# Altium project RockerBox.PrjPCB (part 3 of 3)

## Sheet SMPS.SchDoc: Title
size A1; Date: Date; CompanyName: Integrated Micro-Electronics Bulgaria; Organization: Design & Development Department; Address1: Drawing Type; Address2: Address 1; Address3: Address 2; Address4: Address 3; DocumentNumber: 730xxx; Revision: 01; SheetNumber: 1; SheetTotal: 1; PageSetup: Record=PageOptions|CenterHorizontal=True|CenterVertical=True|PrintScale=0.70|XCorrection=1.00|YCorrection=1.00|PrintKind=2|BorderSize=5000000|LeftOffset=0|BottomOffset=0|Orientation=2|PaperLength=1000|PaperWidth=1000|Scale=100|PaperSource=7|PrintQuality=-4|MediaType=1|DitherType=10|PaperKind=A4|PrintScaleMode=1; SheetSize: A3; Time: Time; ModifiedDate: Mod. Date
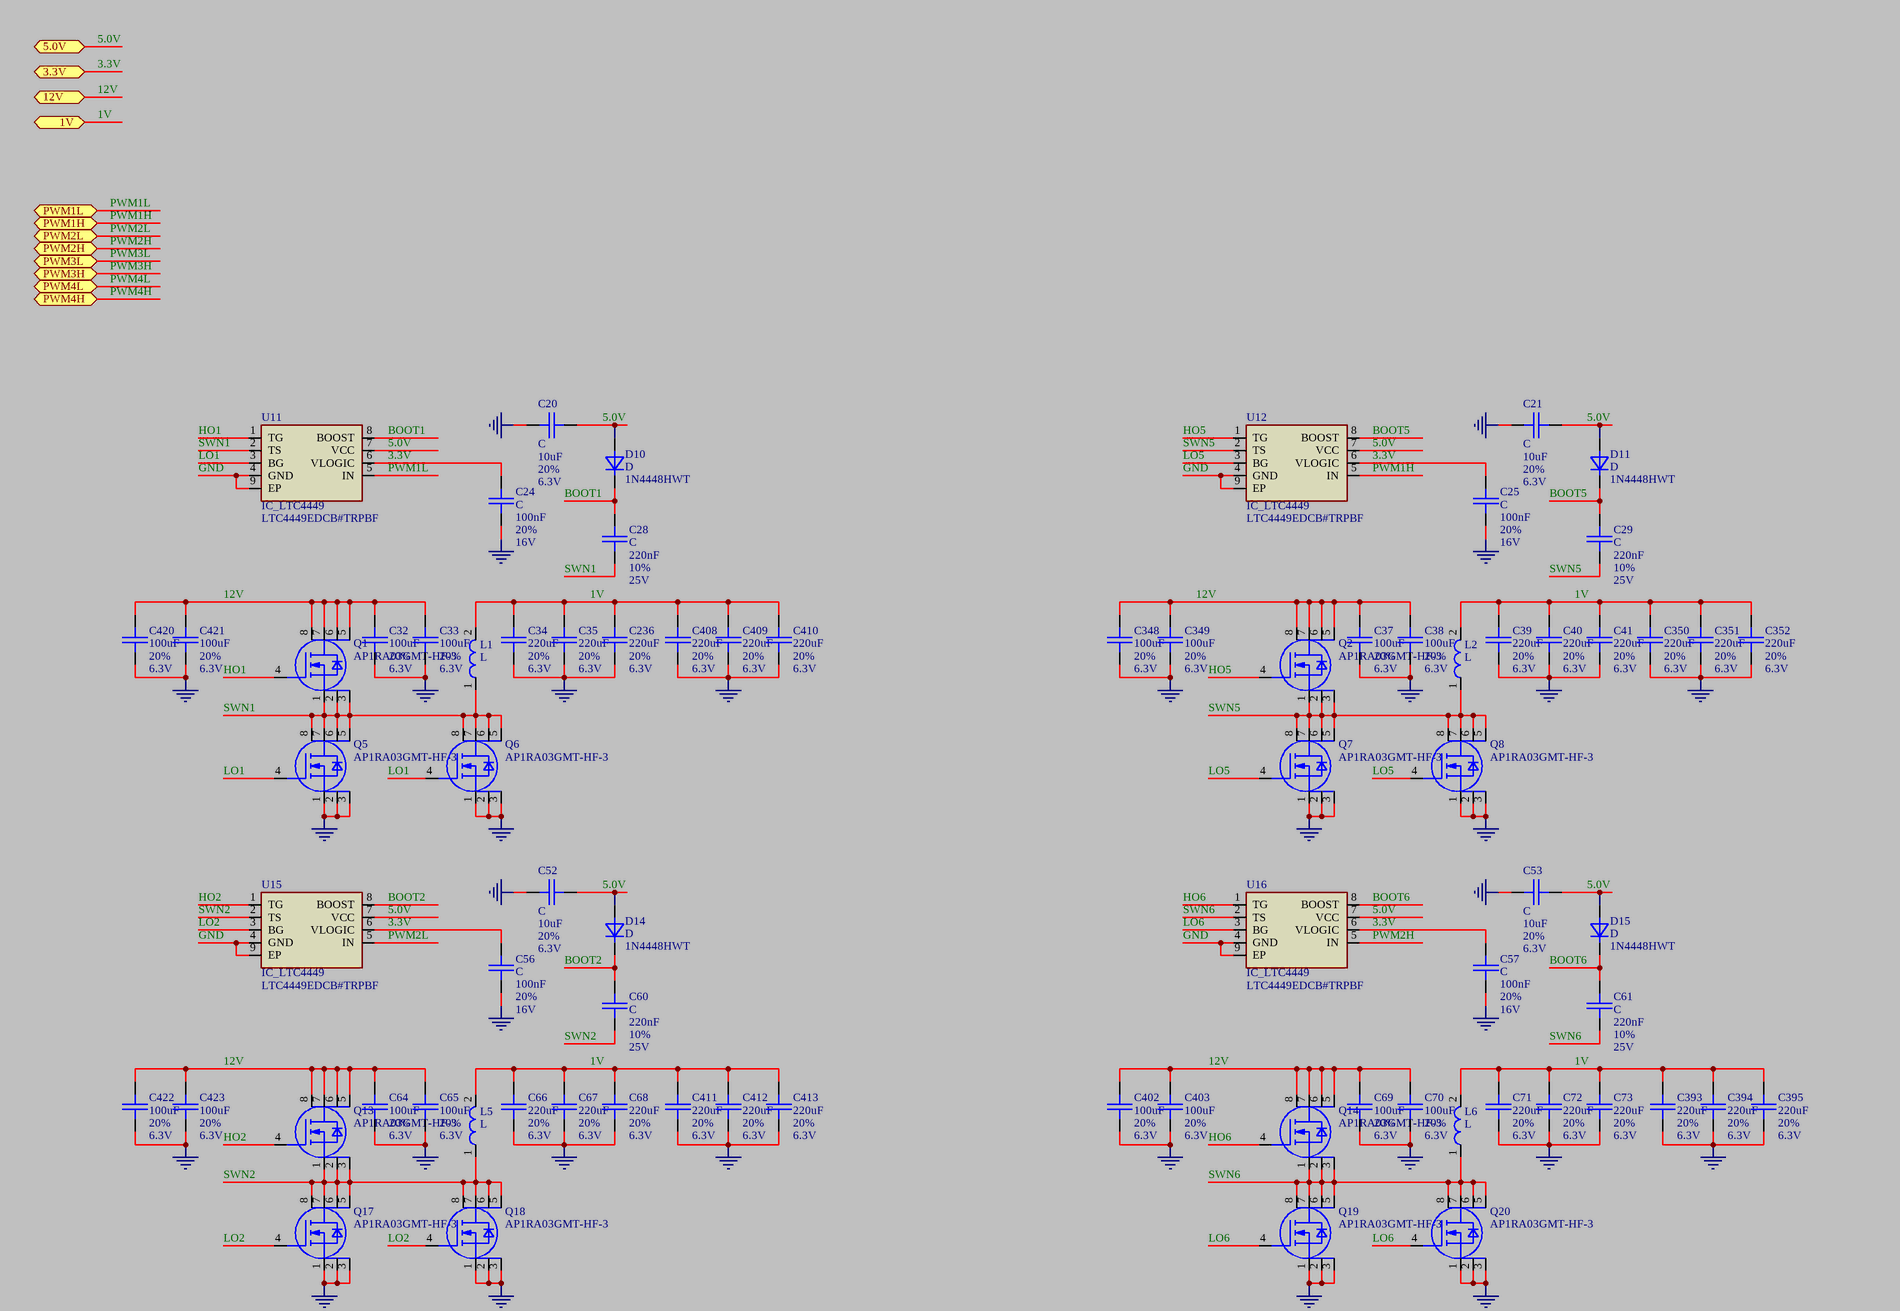
[diagram p7: SMPS.SchDoc, top left]
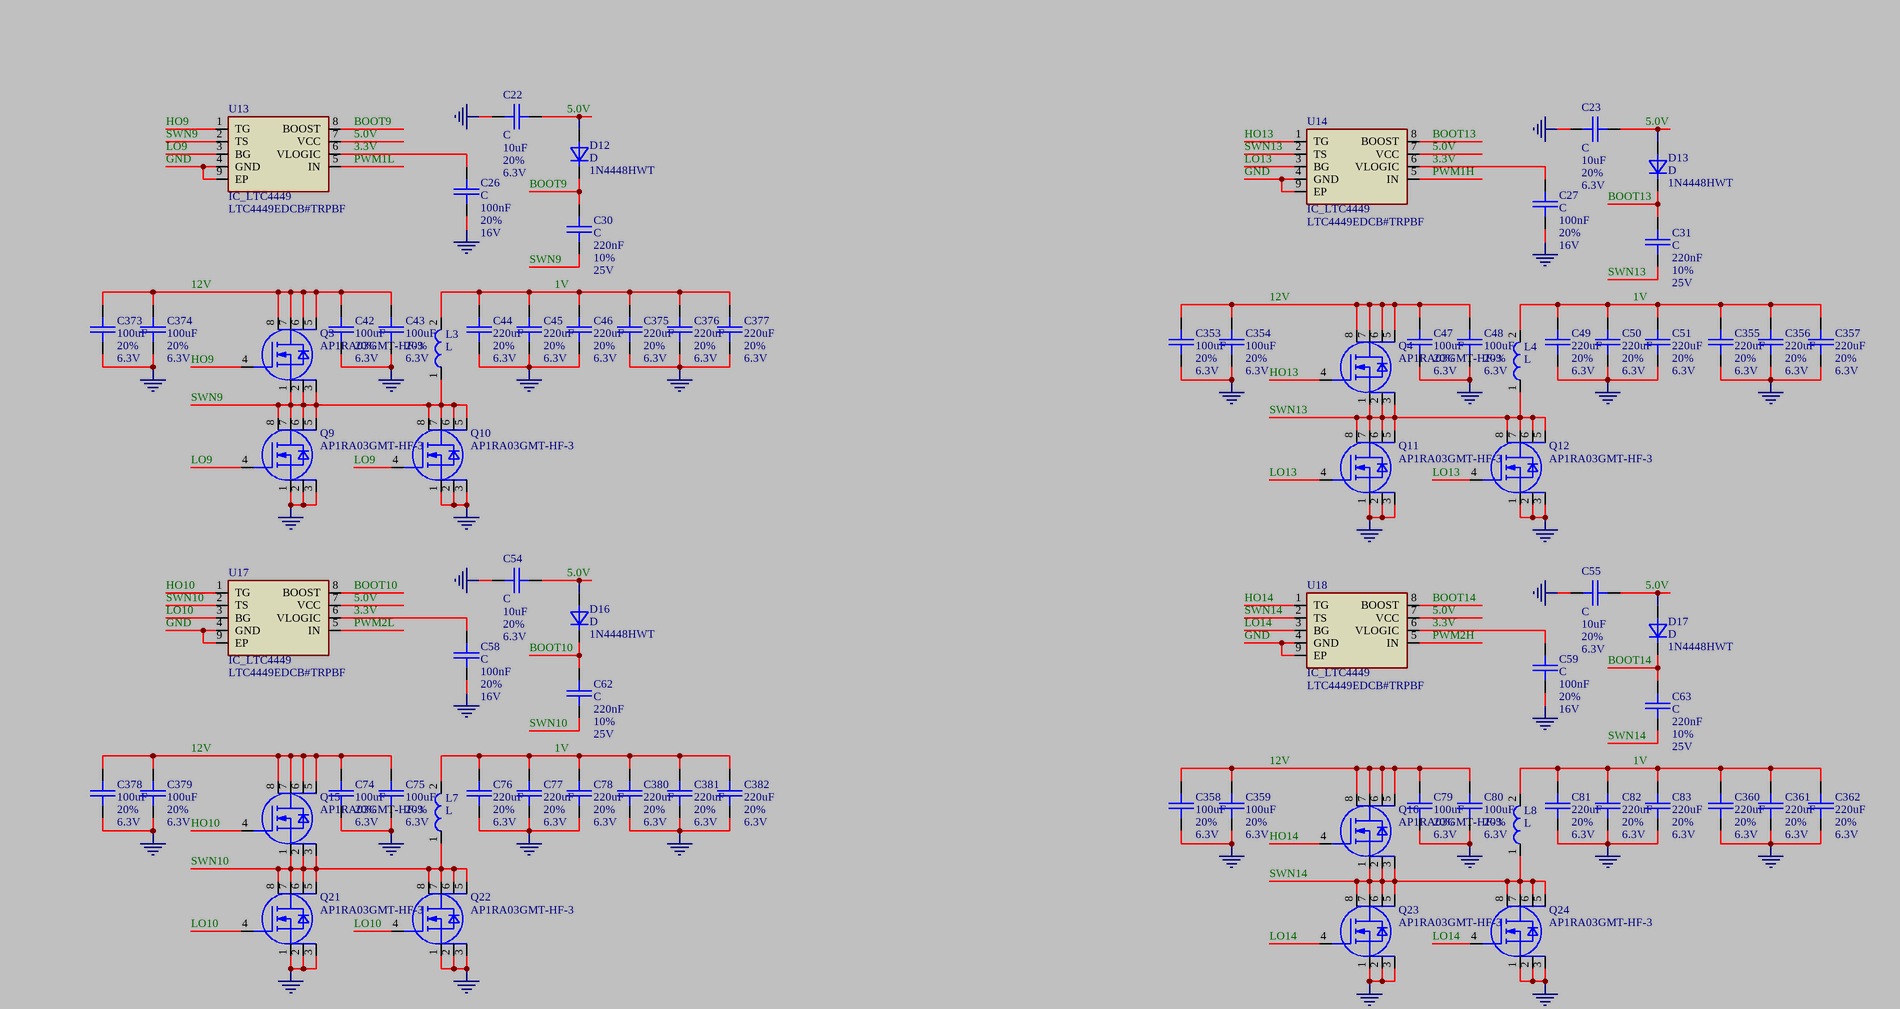
[diagram p8: SMPS.SchDoc, top right]
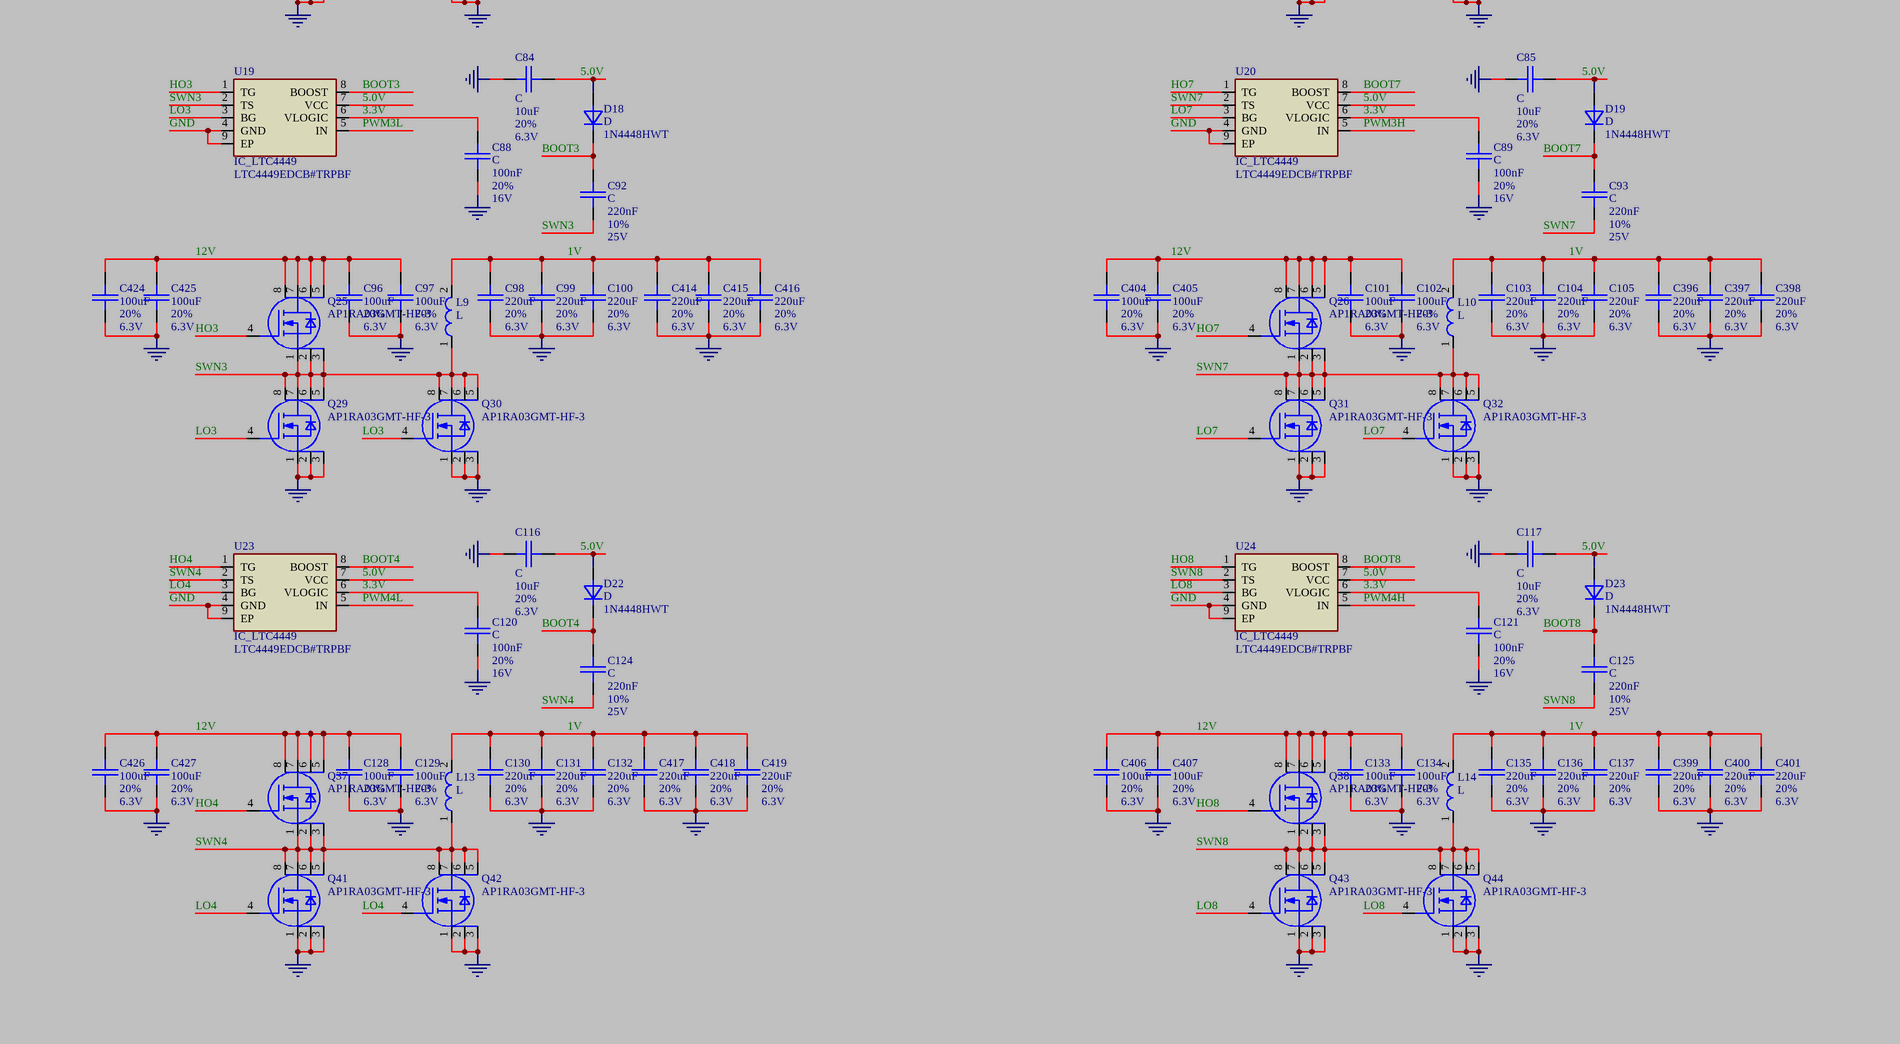
[diagram p9: SMPS.SchDoc, bottom left]
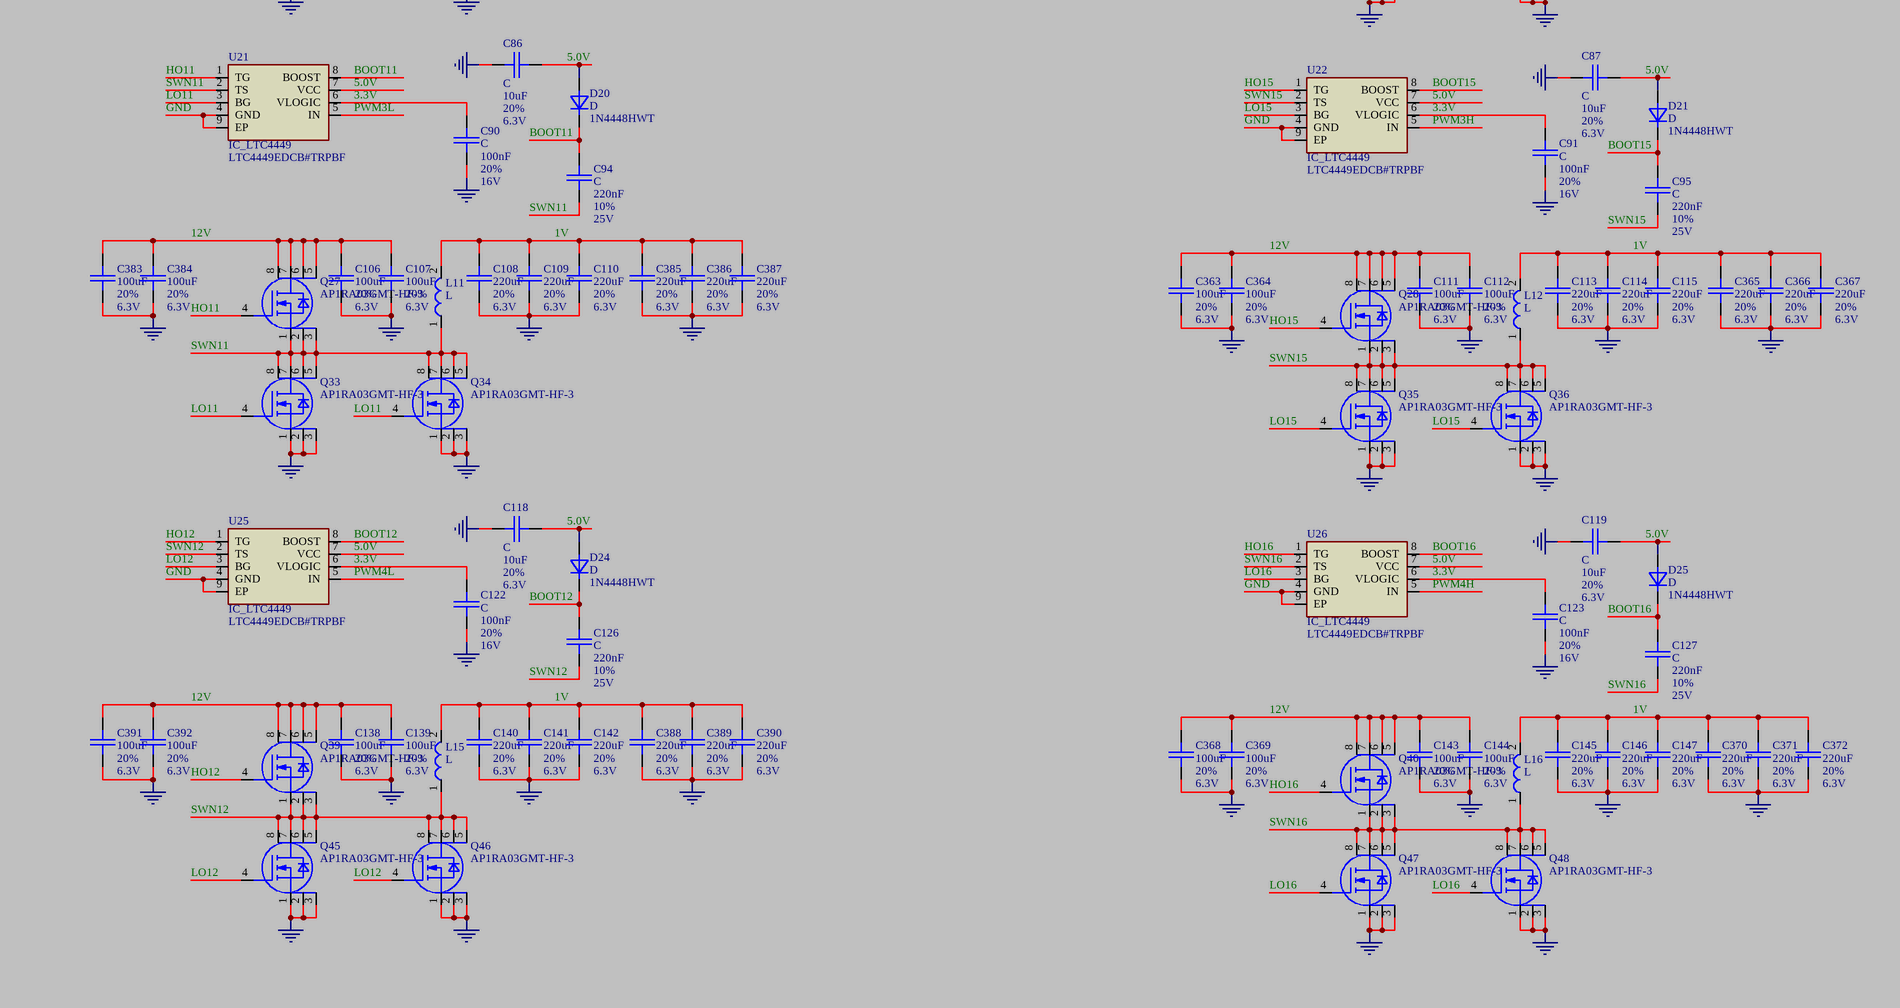
[diagram p10: SMPS.SchDoc, bottom right]

### Parts
C20  C  DB_VALUE: 10uF  DB_TOLERANCE: 20%  DB_VOLTAGE: 6.3V  [SMD_0603_CAPC1608X95N]
C21  C  DB_VALUE: 10uF  DB_TOLERANCE: 20%  DB_VOLTAGE: 6.3V  [SMD_0603_CAPC1608X95N]
C22  C  DB_VALUE: 10uF  DB_TOLERANCE: 20%  DB_VOLTAGE: 6.3V  [SMD_0603_CAPC1608X95N]
C23  C  DB_VALUE: 10uF  DB_TOLERANCE: 20%  DB_VOLTAGE: 6.3V  [SMD_0603_CAPC1608X95N]
C24  C  DB_VALUE: 100nF  DB_TOLERANCE: 20%  DB_VOLTAGE: 16V  [SMD_0402_CAPC1005X55N]
C25  C  DB_VALUE: 100nF  DB_TOLERANCE: 20%  DB_VOLTAGE: 16V  [SMD_0402_CAPC1005X55N]
C26  C  DB_VALUE: 100nF  DB_TOLERANCE: 20%  DB_VOLTAGE: 16V  [SMD_0402_CAPC1005X55N]
C27  C  DB_VALUE: 100nF  DB_TOLERANCE: 20%  DB_VOLTAGE: 16V  [SMD_0402_CAPC1005X55N]
C28  C  DB_VALUE: 220nF  DB_TOLERANCE: 10%  DB_VOLTAGE: 25V  [SMD_0603_CAPC1608X95N]
C29  C  DB_VALUE: 220nF  DB_TOLERANCE: 10%  DB_VOLTAGE: 25V  [SMD_0603_CAPC1608X95N]
C30  C  DB_VALUE: 220nF  DB_TOLERANCE: 10%  DB_VOLTAGE: 25V  [SMD_0603_CAPC1608X95N]
C31  C  DB_VALUE: 220nF  DB_TOLERANCE: 10%  DB_VOLTAGE: 25V  [SMD_0603_CAPC1608X95N]
C32  DB_VALUE: 100uF  DB_TOLERANCE: 20%  DB_VOLTAGE: 6.3V  [SMD_1210_CAPC3225X270N]  (hidden comment: C)
C33  DB_VALUE: 100uF  DB_TOLERANCE: 20%  DB_VOLTAGE: 6.3V  [SMD_1210_CAPC3225X270N]  (hidden comment: C)
C34  DB_VALUE: 220uF  DB_TOLERANCE: 20%  DB_VOLTAGE: 6.3V  [SMD_1210_CAPC3225X279N]  (hidden comment: C)
C35  DB_VALUE: 220uF  DB_TOLERANCE: 20%  DB_VOLTAGE: 6.3V  [SMD_1210_CAPC3225X279N]  (hidden comment: C)
C37  DB_VALUE: 100uF  DB_TOLERANCE: 20%  DB_VOLTAGE: 6.3V  [SMD_1210_CAPC3225X270N]  (hidden comment: C)
C38  DB_VALUE: 100uF  DB_TOLERANCE: 20%  DB_VOLTAGE: 6.3V  [SMD_1210_CAPC3225X270N]  (hidden comment: C)
C39  DB_VALUE: 220uF  DB_TOLERANCE: 20%  DB_VOLTAGE: 6.3V  [SMD_1210_CAPC3225X279N]  (hidden comment: C)
C40  DB_VALUE: 220uF  DB_TOLERANCE: 20%  DB_VOLTAGE: 6.3V  [SMD_1210_CAPC3225X279N]  (hidden comment: C)
C41  DB_VALUE: 220uF  DB_TOLERANCE: 20%  DB_VOLTAGE: 6.3V  [SMD_1210_CAPC3225X279N]  (hidden comment: C)
C42  DB_VALUE: 100uF  DB_TOLERANCE: 20%  DB_VOLTAGE: 6.3V  [SMD_1210_CAPC3225X270N]  (hidden comment: C)
C43  DB_VALUE: 100uF  DB_TOLERANCE: 20%  DB_VOLTAGE: 6.3V  [SMD_1210_CAPC3225X270N]  (hidden comment: C)
C44  DB_VALUE: 220uF  DB_TOLERANCE: 20%  DB_VOLTAGE: 6.3V  [SMD_1210_CAPC3225X279N]  (hidden comment: C)
C45  DB_VALUE: 220uF  DB_TOLERANCE: 20%  DB_VOLTAGE: 6.3V  [SMD_1210_CAPC3225X279N]  (hidden comment: C)
C46  DB_VALUE: 220uF  DB_TOLERANCE: 20%  DB_VOLTAGE: 6.3V  [SMD_1210_CAPC3225X279N]  (hidden comment: C)
C47  DB_VALUE: 100uF  DB_TOLERANCE: 20%  DB_VOLTAGE: 6.3V  [SMD_1210_CAPC3225X270N]  (hidden comment: C)
C48  DB_VALUE: 100uF  DB_TOLERANCE: 20%  DB_VOLTAGE: 6.3V  [SMD_1210_CAPC3225X270N]  (hidden comment: C)
C49  DB_VALUE: 220uF  DB_TOLERANCE: 20%  DB_VOLTAGE: 6.3V  [SMD_1210_CAPC3225X279N]  (hidden comment: C)
C50  DB_VALUE: 220uF  DB_TOLERANCE: 20%  DB_VOLTAGE: 6.3V  [SMD_1210_CAPC3225X279N]  (hidden comment: C)
C51  DB_VALUE: 220uF  DB_TOLERANCE: 20%  DB_VOLTAGE: 6.3V  [SMD_1210_CAPC3225X279N]  (hidden comment: C)
C52  C  DB_VALUE: 10uF  DB_TOLERANCE: 20%  DB_VOLTAGE: 6.3V  [SMD_0603_CAPC1608X95N]
C53  C  DB_VALUE: 10uF  DB_TOLERANCE: 20%  DB_VOLTAGE: 6.3V  [SMD_0603_CAPC1608X95N]
C54  C  DB_VALUE: 10uF  DB_TOLERANCE: 20%  DB_VOLTAGE: 6.3V  [SMD_0603_CAPC1608X95N]
C55  C  DB_VALUE: 10uF  DB_TOLERANCE: 20%  DB_VOLTAGE: 6.3V  [SMD_0603_CAPC1608X95N]
C56  C  DB_VALUE: 100nF  DB_TOLERANCE: 20%  DB_VOLTAGE: 16V  [SMD_0402_CAPC1005X55N]
C57  C  DB_VALUE: 100nF  DB_TOLERANCE: 20%  DB_VOLTAGE: 16V  [SMD_0402_CAPC1005X55N]
C58  C  DB_VALUE: 100nF  DB_TOLERANCE: 20%  DB_VOLTAGE: 16V  [SMD_0402_CAPC1005X55N]
C59  C  DB_VALUE: 100nF  DB_TOLERANCE: 20%  DB_VOLTAGE: 16V  [SMD_0402_CAPC1005X55N]
C60  C  DB_VALUE: 220nF  DB_TOLERANCE: 10%  DB_VOLTAGE: 25V  [SMD_0603_CAPC1608X95N]
C61  C  DB_VALUE: 220nF  DB_TOLERANCE: 10%  DB_VOLTAGE: 25V  [SMD_0603_CAPC1608X95N]
C62  C  DB_VALUE: 220nF  DB_TOLERANCE: 10%  DB_VOLTAGE: 25V  [SMD_0603_CAPC1608X95N]
C63  C  DB_VALUE: 220nF  DB_TOLERANCE: 10%  DB_VOLTAGE: 25V  [SMD_0603_CAPC1608X95N]
C64  DB_VALUE: 100uF  DB_TOLERANCE: 20%  DB_VOLTAGE: 6.3V  [SMD_1210_CAPC3225X270N]  (hidden comment: C)
C65  DB_VALUE: 100uF  DB_TOLERANCE: 20%  DB_VOLTAGE: 6.3V  [SMD_1210_CAPC3225X270N]  (hidden comment: C)
C66  DB_VALUE: 220uF  DB_TOLERANCE: 20%  DB_VOLTAGE: 6.3V  [SMD_1210_CAPC3225X279N]  (hidden comment: C)
C67  DB_VALUE: 220uF  DB_TOLERANCE: 20%  DB_VOLTAGE: 6.3V  [SMD_1210_CAPC3225X279N]  (hidden comment: C)
C68  DB_VALUE: 220uF  DB_TOLERANCE: 20%  DB_VOLTAGE: 6.3V  [SMD_1210_CAPC3225X279N]  (hidden comment: C)
C69  DB_VALUE: 100uF  DB_TOLERANCE: 20%  DB_VOLTAGE: 6.3V  [SMD_1210_CAPC3225X270N]  (hidden comment: C)
C70  DB_VALUE: 100uF  DB_TOLERANCE: 20%  DB_VOLTAGE: 6.3V  [SMD_1210_CAPC3225X270N]  (hidden comment: C)
C71  DB_VALUE: 220uF  DB_TOLERANCE: 20%  DB_VOLTAGE: 6.3V  [SMD_1210_CAPC3225X279N]  (hidden comment: C)
C72  DB_VALUE: 220uF  DB_TOLERANCE: 20%  DB_VOLTAGE: 6.3V  [SMD_1210_CAPC3225X279N]  (hidden comment: C)
C73  DB_VALUE: 220uF  DB_TOLERANCE: 20%  DB_VOLTAGE: 6.3V  [SMD_1210_CAPC3225X279N]  (hidden comment: C)
C74  DB_VALUE: 100uF  DB_TOLERANCE: 20%  DB_VOLTAGE: 6.3V  [SMD_1210_CAPC3225X270N]  (hidden comment: C)
C75  DB_VALUE: 100uF  DB_TOLERANCE: 20%  DB_VOLTAGE: 6.3V  [SMD_1210_CAPC3225X270N]  (hidden comment: C)
C76  DB_VALUE: 220uF  DB_TOLERANCE: 20%  DB_VOLTAGE: 6.3V  [SMD_1210_CAPC3225X279N]  (hidden comment: C)
C77  DB_VALUE: 220uF  DB_TOLERANCE: 20%  DB_VOLTAGE: 6.3V  [SMD_1210_CAPC3225X279N]  (hidden comment: C)
C78  DB_VALUE: 220uF  DB_TOLERANCE: 20%  DB_VOLTAGE: 6.3V  [SMD_1210_CAPC3225X279N]  (hidden comment: C)
C79  DB_VALUE: 100uF  DB_TOLERANCE: 20%  DB_VOLTAGE: 6.3V  [SMD_1210_CAPC3225X270N]  (hidden comment: C)
C80  DB_VALUE: 100uF  DB_TOLERANCE: 20%  DB_VOLTAGE: 6.3V  [SMD_1210_CAPC3225X270N]  (hidden comment: C)
C81  DB_VALUE: 220uF  DB_TOLERANCE: 20%  DB_VOLTAGE: 6.3V  [SMD_1210_CAPC3225X279N]  (hidden comment: C)
C82  DB_VALUE: 220uF  DB_TOLERANCE: 20%  DB_VOLTAGE: 6.3V  [SMD_1210_CAPC3225X279N]  (hidden comment: C)
C83  DB_VALUE: 220uF  DB_TOLERANCE: 20%  DB_VOLTAGE: 6.3V  [SMD_1210_CAPC3225X279N]  (hidden comment: C)
C84  C  DB_VALUE: 10uF  DB_TOLERANCE: 20%  DB_VOLTAGE: 6.3V  [SMD_0603_CAPC1608X95N]
C85  C  DB_VALUE: 10uF  DB_TOLERANCE: 20%  DB_VOLTAGE: 6.3V  [SMD_0603_CAPC1608X95N]
C86  C  DB_VALUE: 10uF  DB_TOLERANCE: 20%  DB_VOLTAGE: 6.3V  [SMD_0603_CAPC1608X95N]
C87  C  DB_VALUE: 10uF  DB_TOLERANCE: 20%  DB_VOLTAGE: 6.3V  [SMD_0603_CAPC1608X95N]
C88  C  DB_VALUE: 100nF  DB_TOLERANCE: 20%  DB_VOLTAGE: 16V  [SMD_0402_CAPC1005X55N]
C89  C  DB_VALUE: 100nF  DB_TOLERANCE: 20%  DB_VOLTAGE: 16V  [SMD_0402_CAPC1005X55N]
C90  C  DB_VALUE: 100nF  DB_TOLERANCE: 20%  DB_VOLTAGE: 16V  [SMD_0402_CAPC1005X55N]
C91  C  DB_VALUE: 100nF  DB_TOLERANCE: 20%  DB_VOLTAGE: 16V  [SMD_0402_CAPC1005X55N]
C92  C  DB_VALUE: 220nF  DB_TOLERANCE: 10%  DB_VOLTAGE: 25V  [SMD_0603_CAPC1608X95N]
C93  C  DB_VALUE: 220nF  DB_TOLERANCE: 10%  DB_VOLTAGE: 25V  [SMD_0603_CAPC1608X95N]
C94  C  DB_VALUE: 220nF  DB_TOLERANCE: 10%  DB_VOLTAGE: 25V  [SMD_0603_CAPC1608X95N]
C95  C  DB_VALUE: 220nF  DB_TOLERANCE: 10%  DB_VOLTAGE: 25V  [SMD_0603_CAPC1608X95N]
C96  DB_VALUE: 100uF  DB_TOLERANCE: 20%  DB_VOLTAGE: 6.3V  [SMD_1210_CAPC3225X270N]  (hidden comment: C)
C97  DB_VALUE: 100uF  DB_TOLERANCE: 20%  DB_VOLTAGE: 6.3V  [SMD_1210_CAPC3225X270N]  (hidden comment: C)
C98  DB_VALUE: 220uF  DB_TOLERANCE: 20%  DB_VOLTAGE: 6.3V  [SMD_1210_CAPC3225X279N]  (hidden comment: C)
C99  DB_VALUE: 220uF  DB_TOLERANCE: 20%  DB_VOLTAGE: 6.3V  [SMD_1210_CAPC3225X279N]  (hidden comment: C)
C100  DB_VALUE: 220uF  DB_TOLERANCE: 20%  DB_VOLTAGE: 6.3V  [SMD_1210_CAPC3225X279N]  (hidden comment: C)
C101  DB_VALUE: 100uF  DB_TOLERANCE: 20%  DB_VOLTAGE: 6.3V  [SMD_1210_CAPC3225X270N]  (hidden comment: C)
C102  DB_VALUE: 100uF  DB_TOLERANCE: 20%  DB_VOLTAGE: 6.3V  [SMD_1210_CAPC3225X270N]  (hidden comment: C)
C103  DB_VALUE: 220uF  DB_TOLERANCE: 20%  DB_VOLTAGE: 6.3V  [SMD_1210_CAPC3225X279N]  (hidden comment: C)
C104  DB_VALUE: 220uF  DB_TOLERANCE: 20%  DB_VOLTAGE: 6.3V  [SMD_1210_CAPC3225X279N]  (hidden comment: C)
C105  DB_VALUE: 220uF  DB_TOLERANCE: 20%  DB_VOLTAGE: 6.3V  [SMD_1210_CAPC3225X279N]  (hidden comment: C)
C106  DB_VALUE: 100uF  DB_TOLERANCE: 20%  DB_VOLTAGE: 6.3V  [SMD_1210_CAPC3225X270N]  (hidden comment: C)
C107  DB_VALUE: 100uF  DB_TOLERANCE: 20%  DB_VOLTAGE: 6.3V  [SMD_1210_CAPC3225X270N]  (hidden comment: C)
C108  DB_VALUE: 220uF  DB_TOLERANCE: 20%  DB_VOLTAGE: 6.3V  [SMD_1210_CAPC3225X279N]  (hidden comment: C)
C109  DB_VALUE: 220uF  DB_TOLERANCE: 20%  DB_VOLTAGE: 6.3V  [SMD_1210_CAPC3225X279N]  (hidden comment: C)
C110  DB_VALUE: 220uF  DB_TOLERANCE: 20%  DB_VOLTAGE: 6.3V  [SMD_1210_CAPC3225X279N]  (hidden comment: C)
C111  DB_VALUE: 100uF  DB_TOLERANCE: 20%  DB_VOLTAGE: 6.3V  [SMD_1210_CAPC3225X270N]  (hidden comment: C)
C112  DB_VALUE: 100uF  DB_TOLERANCE: 20%  DB_VOLTAGE: 6.3V  [SMD_1210_CAPC3225X270N]  (hidden comment: C)
C113  DB_VALUE: 220uF  DB_TOLERANCE: 20%  DB_VOLTAGE: 6.3V  [SMD_1210_CAPC3225X279N]  (hidden comment: C)
C114  DB_VALUE: 220uF  DB_TOLERANCE: 20%  DB_VOLTAGE: 6.3V  [SMD_1210_CAPC3225X279N]  (hidden comment: C)
C115  DB_VALUE: 220uF  DB_TOLERANCE: 20%  DB_VOLTAGE: 6.3V  [SMD_1210_CAPC3225X279N]  (hidden comment: C)
C116  C  DB_VALUE: 10uF  DB_TOLERANCE: 20%  DB_VOLTAGE: 6.3V  [SMD_0603_CAPC1608X95N]
C117  C  DB_VALUE: 10uF  DB_TOLERANCE: 20%  DB_VOLTAGE: 6.3V  [SMD_0603_CAPC1608X95N]
C118  C  DB_VALUE: 10uF  DB_TOLERANCE: 20%  DB_VOLTAGE: 6.3V  [SMD_0603_CAPC1608X95N]
C119  C  DB_VALUE: 10uF  DB_TOLERANCE: 20%  DB_VOLTAGE: 6.3V  [SMD_0603_CAPC1608X95N]
C120  C  DB_VALUE: 100nF  DB_TOLERANCE: 20%  DB_VOLTAGE: 16V  [SMD_0402_CAPC1005X55N]
C121  C  DB_VALUE: 100nF  DB_TOLERANCE: 20%  DB_VOLTAGE: 16V  [SMD_0402_CAPC1005X55N]
C122  C  DB_VALUE: 100nF  DB_TOLERANCE: 20%  DB_VOLTAGE: 16V  [SMD_0402_CAPC1005X55N]
C123  C  DB_VALUE: 100nF  DB_TOLERANCE: 20%  DB_VOLTAGE: 16V  [SMD_0402_CAPC1005X55N]
C124  C  DB_VALUE: 220nF  DB_TOLERANCE: 10%  DB_VOLTAGE: 25V  [SMD_0603_CAPC1608X95N]
C125  C  DB_VALUE: 220nF  DB_TOLERANCE: 10%  DB_VOLTAGE: 25V  [SMD_0603_CAPC1608X95N]
C126  C  DB_VALUE: 220nF  DB_TOLERANCE: 10%  DB_VOLTAGE: 25V  [SMD_0603_CAPC1608X95N]
C127  C  DB_VALUE: 220nF  DB_TOLERANCE: 10%  DB_VOLTAGE: 25V  [SMD_0603_CAPC1608X95N]
C128  DB_VALUE: 100uF  DB_TOLERANCE: 20%  DB_VOLTAGE: 6.3V  [SMD_1210_CAPC3225X270N]  (hidden comment: C)
C129  DB_VALUE: 100uF  DB_TOLERANCE: 20%  DB_VOLTAGE: 6.3V  [SMD_1210_CAPC3225X270N]  (hidden comment: C)
C130  DB_VALUE: 220uF  DB_TOLERANCE: 20%  DB_VOLTAGE: 6.3V  [SMD_1210_CAPC3225X279N]  (hidden comment: C)
C131  DB_VALUE: 220uF  DB_TOLERANCE: 20%  DB_VOLTAGE: 6.3V  [SMD_1210_CAPC3225X279N]  (hidden comment: C)
C132  DB_VALUE: 220uF  DB_TOLERANCE: 20%  DB_VOLTAGE: 6.3V  [SMD_1210_CAPC3225X279N]  (hidden comment: C)
C133  DB_VALUE: 100uF  DB_TOLERANCE: 20%  DB_VOLTAGE: 6.3V  [SMD_1210_CAPC3225X270N]  (hidden comment: C)
C134  DB_VALUE: 100uF  DB_TOLERANCE: 20%  DB_VOLTAGE: 6.3V  [SMD_1210_CAPC3225X270N]  (hidden comment: C)
C135  DB_VALUE: 220uF  DB_TOLERANCE: 20%  DB_VOLTAGE: 6.3V  [SMD_1210_CAPC3225X279N]  (hidden comment: C)
C136  DB_VALUE: 220uF  DB_TOLERANCE: 20%  DB_VOLTAGE: 6.3V  [SMD_1210_CAPC3225X279N]  (hidden comment: C)
C137  DB_VALUE: 220uF  DB_TOLERANCE: 20%  DB_VOLTAGE: 6.3V  [SMD_1210_CAPC3225X279N]  (hidden comment: C)
C138  DB_VALUE: 100uF  DB_TOLERANCE: 20%  DB_VOLTAGE: 6.3V  [SMD_1210_CAPC3225X270N]  (hidden comment: C)
C139  DB_VALUE: 100uF  DB_TOLERANCE: 20%  DB_VOLTAGE: 6.3V  [SMD_1210_CAPC3225X270N]  (hidden comment: C)
C140  DB_VALUE: 220uF  DB_TOLERANCE: 20%  DB_VOLTAGE: 6.3V  [SMD_1210_CAPC3225X279N]  (hidden comment: C)
C141  DB_VALUE: 220uF  DB_TOLERANCE: 20%  DB_VOLTAGE: 6.3V  [SMD_1210_CAPC3225X279N]  (hidden comment: C)
C142  DB_VALUE: 220uF  DB_TOLERANCE: 20%  DB_VOLTAGE: 6.3V  [SMD_1210_CAPC3225X279N]  (hidden comment: C)
C143  DB_VALUE: 100uF  DB_TOLERANCE: 20%  DB_VOLTAGE: 6.3V  [SMD_1210_CAPC3225X270N]  (hidden comment: C)
C144  DB_VALUE: 100uF  DB_TOLERANCE: 20%  DB_VOLTAGE: 6.3V  [SMD_1210_CAPC3225X270N]  (hidden comment: C)
C145  DB_VALUE: 220uF  DB_TOLERANCE: 20%  DB_VOLTAGE: 6.3V  [SMD_1210_CAPC3225X279N]  (hidden comment: C)
C146  DB_VALUE: 220uF  DB_TOLERANCE: 20%  DB_VOLTAGE: 6.3V  [SMD_1210_CAPC3225X279N]  (hidden comment: C)
C147  DB_VALUE: 220uF  DB_TOLERANCE: 20%  DB_VOLTAGE: 6.3V  [SMD_1210_CAPC3225X279N]  (hidden comment: C)
C236  DB_VALUE: 220uF  DB_TOLERANCE: 20%  DB_VOLTAGE: 6.3V  [SMD_1210_CAPC3225X279N]  (hidden comment: C)
C348  DB_VALUE: 100uF  DB_TOLERANCE: 20%  DB_VOLTAGE: 6.3V  [SMD_1210_CAPC3225X270N]  (hidden comment: C)
C349  DB_VALUE: 100uF  DB_TOLERANCE: 20%  DB_VOLTAGE: 6.3V  [SMD_1210_CAPC3225X270N]  (hidden comment: C)
C350  DB_VALUE: 220uF  DB_TOLERANCE: 20%  DB_VOLTAGE: 6.3V  [SMD_1210_CAPC3225X279N]  (hidden comment: C)
C351  DB_VALUE: 220uF  DB_TOLERANCE: 20%  DB_VOLTAGE: 6.3V  [SMD_1210_CAPC3225X279N]  (hidden comment: C)
C352  DB_VALUE: 220uF  DB_TOLERANCE: 20%  DB_VOLTAGE: 6.3V  [SMD_1210_CAPC3225X279N]  (hidden comment: C)
C353  DB_VALUE: 100uF  DB_TOLERANCE: 20%  DB_VOLTAGE: 6.3V  [SMD_1210_CAPC3225X270N]  (hidden comment: C)
C354  DB_VALUE: 100uF  DB_TOLERANCE: 20%  DB_VOLTAGE: 6.3V  [SMD_1210_CAPC3225X270N]  (hidden comment: C)
C355  DB_VALUE: 220uF  DB_TOLERANCE: 20%  DB_VOLTAGE: 6.3V  [SMD_1210_CAPC3225X279N]  (hidden comment: C)
C356  DB_VALUE: 220uF  DB_TOLERANCE: 20%  DB_VOLTAGE: 6.3V  [SMD_1210_CAPC3225X279N]  (hidden comment: C)
C357  DB_VALUE: 220uF  DB_TOLERANCE: 20%  DB_VOLTAGE: 6.3V  [SMD_1210_CAPC3225X279N]  (hidden comment: C)
C358  DB_VALUE: 100uF  DB_TOLERANCE: 20%  DB_VOLTAGE: 6.3V  [SMD_1210_CAPC3225X270N]  (hidden comment: C)
C359  DB_VALUE: 100uF  DB_TOLERANCE: 20%  DB_VOLTAGE: 6.3V  [SMD_1210_CAPC3225X270N]  (hidden comment: C)
C360  DB_VALUE: 220uF  DB_TOLERANCE: 20%  DB_VOLTAGE: 6.3V  [SMD_1210_CAPC3225X279N]  (hidden comment: C)
C361  DB_VALUE: 220uF  DB_TOLERANCE: 20%  DB_VOLTAGE: 6.3V  [SMD_1210_CAPC3225X279N]  (hidden comment: C)
C362  DB_VALUE: 220uF  DB_TOLERANCE: 20%  DB_VOLTAGE: 6.3V  [SMD_1210_CAPC3225X279N]  (hidden comment: C)
C363  DB_VALUE: 100uF  DB_TOLERANCE: 20%  DB_VOLTAGE: 6.3V  [SMD_1210_CAPC3225X270N]  (hidden comment: C)
C364  DB_VALUE: 100uF  DB_TOLERANCE: 20%  DB_VOLTAGE: 6.3V  [SMD_1210_CAPC3225X270N]  (hidden comment: C)
C365  DB_VALUE: 220uF  DB_TOLERANCE: 20%  DB_VOLTAGE: 6.3V  [SMD_1210_CAPC3225X279N]  (hidden comment: C)
C366  DB_VALUE: 220uF  DB_TOLERANCE: 20%  DB_VOLTAGE: 6.3V  [SMD_1210_CAPC3225X279N]  (hidden comment: C)
C367  DB_VALUE: 220uF  DB_TOLERANCE: 20%  DB_VOLTAGE: 6.3V  [SMD_1210_CAPC3225X279N]  (hidden comment: C)
C368  DB_VALUE: 100uF  DB_TOLERANCE: 20%  DB_VOLTAGE: 6.3V  [SMD_1210_CAPC3225X270N]  (hidden comment: C)
C369  DB_VALUE: 100uF  DB_TOLERANCE: 20%  DB_VOLTAGE: 6.3V  [SMD_1210_CAPC3225X270N]  (hidden comment: C)
C370  DB_VALUE: 220uF  DB_TOLERANCE: 20%  DB_VOLTAGE: 6.3V  [SMD_1210_CAPC3225X279N]  (hidden comment: C)
C371  DB_VALUE: 220uF  DB_TOLERANCE: 20%  DB_VOLTAGE: 6.3V  [SMD_1210_CAPC3225X279N]  (hidden comment: C)
C372  DB_VALUE: 220uF  DB_TOLERANCE: 20%  DB_VOLTAGE: 6.3V  [SMD_1210_CAPC3225X279N]  (hidden comment: C)
C373  DB_VALUE: 100uF  DB_TOLERANCE: 20%  DB_VOLTAGE: 6.3V  [SMD_1210_CAPC3225X270N]  (hidden comment: C)
C374  DB_VALUE: 100uF  DB_TOLERANCE: 20%  DB_VOLTAGE: 6.3V  [SMD_1210_CAPC3225X270N]  (hidden comment: C)
C375  DB_VALUE: 220uF  DB_TOLERANCE: 20%  DB_VOLTAGE: 6.3V  [SMD_1210_CAPC3225X279N]  (hidden comment: C)
C376  DB_VALUE: 220uF  DB_TOLERANCE: 20%  DB_VOLTAGE: 6.3V  [SMD_1210_CAPC3225X279N]  (hidden comment: C)
C377  DB_VALUE: 220uF  DB_TOLERANCE: 20%  DB_VOLTAGE: 6.3V  [SMD_1210_CAPC3225X279N]  (hidden comment: C)
C378  DB_VALUE: 100uF  DB_TOLERANCE: 20%  DB_VOLTAGE: 6.3V  [SMD_1210_CAPC3225X270N]  (hidden comment: C)
C379  DB_VALUE: 100uF  DB_TOLERANCE: 20%  DB_VOLTAGE: 6.3V  [SMD_1210_CAPC3225X270N]  (hidden comment: C)
C380  DB_VALUE: 220uF  DB_TOLERANCE: 20%  DB_VOLTAGE: 6.3V  [SMD_1210_CAPC3225X279N]  (hidden comment: C)
C381  DB_VALUE: 220uF  DB_TOLERANCE: 20%  DB_VOLTAGE: 6.3V  [SMD_1210_CAPC3225X279N]  (hidden comment: C)
C382  DB_VALUE: 220uF  DB_TOLERANCE: 20%  DB_VOLTAGE: 6.3V  [SMD_1210_CAPC3225X279N]  (hidden comment: C)
C383  DB_VALUE: 100uF  DB_TOLERANCE: 20%  DB_VOLTAGE: 6.3V  [SMD_1210_CAPC3225X270N]  (hidden comment: C)
C384  DB_VALUE: 100uF  DB_TOLERANCE: 20%  DB_VOLTAGE: 6.3V  [SMD_1210_CAPC3225X270N]  (hidden comment: C)
C385  DB_VALUE: 220uF  DB_TOLERANCE: 20%  DB_VOLTAGE: 6.3V  [SMD_1210_CAPC3225X279N]  (hidden comment: C)
C386  DB_VALUE: 220uF  DB_TOLERANCE: 20%  DB_VOLTAGE: 6.3V  [SMD_1210_CAPC3225X279N]  (hidden comment: C)
C387  DB_VALUE: 220uF  DB_TOLERANCE: 20%  DB_VOLTAGE: 6.3V  [SMD_1210_CAPC3225X279N]  (hidden comment: C)
C388  DB_VALUE: 220uF  DB_TOLERANCE: 20%  DB_VOLTAGE: 6.3V  [SMD_1210_CAPC3225X279N]  (hidden comment: C)
C389  DB_VALUE: 220uF  DB_TOLERANCE: 20%  DB_VOLTAGE: 6.3V  [SMD_1210_CAPC3225X279N]  (hidden comment: C)
C390  DB_VALUE: 220uF  DB_TOLERANCE: 20%  DB_VOLTAGE: 6.3V  [SMD_1210_CAPC3225X279N]  (hidden comment: C)
C391  DB_VALUE: 100uF  DB_TOLERANCE: 20%  DB_VOLTAGE: 6.3V  [SMD_1210_CAPC3225X270N]  (hidden comment: C)
C392  DB_VALUE: 100uF  DB_TOLERANCE: 20%  DB_VOLTAGE: 6.3V  [SMD_1210_CAPC3225X270N]  (hidden comment: C)
C393  DB_VALUE: 220uF  DB_TOLERANCE: 20%  DB_VOLTAGE: 6.3V  [SMD_1210_CAPC3225X279N]  (hidden comment: C)
C394  DB_VALUE: 220uF  DB_TOLERANCE: 20%  DB_VOLTAGE: 6.3V  [SMD_1210_CAPC3225X279N]  (hidden comment: C)
C395  DB_VALUE: 220uF  DB_TOLERANCE: 20%  DB_VOLTAGE: 6.3V  [SMD_1210_CAPC3225X279N]  (hidden comment: C)
C396  DB_VALUE: 220uF  DB_TOLERANCE: 20%  DB_VOLTAGE: 6.3V  [SMD_1210_CAPC3225X279N]  (hidden comment: C)
C397  DB_VALUE: 220uF  DB_TOLERANCE: 20%  DB_VOLTAGE: 6.3V  [SMD_1210_CAPC3225X279N]  (hidden comment: C)
C398  DB_VALUE: 220uF  DB_TOLERANCE: 20%  DB_VOLTAGE: 6.3V  [SMD_1210_CAPC3225X279N]  (hidden comment: C)
C399  DB_VALUE: 220uF  DB_TOLERANCE: 20%  DB_VOLTAGE: 6.3V  [SMD_1210_CAPC3225X279N]  (hidden comment: C)
C400  DB_VALUE: 220uF  DB_TOLERANCE: 20%  DB_VOLTAGE: 6.3V  [SMD_1210_CAPC3225X279N]  (hidden comment: C)
C401  DB_VALUE: 220uF  DB_TOLERANCE: 20%  DB_VOLTAGE: 6.3V  [SMD_1210_CAPC3225X279N]  (hidden comment: C)
C402  DB_VALUE: 100uF  DB_TOLERANCE: 20%  DB_VOLTAGE: 6.3V  [SMD_1210_CAPC3225X270N]  (hidden comment: C)
C403  DB_VALUE: 100uF  DB_TOLERANCE: 20%  DB_VOLTAGE: 6.3V  [SMD_1210_CAPC3225X270N]  (hidden comment: C)
C404  DB_VALUE: 100uF  DB_TOLERANCE: 20%  DB_VOLTAGE: 6.3V  [SMD_1210_CAPC3225X270N]  (hidden comment: C)
C405  DB_VALUE: 100uF  DB_TOLERANCE: 20%  DB_VOLTAGE: 6.3V  [SMD_1210_CAPC3225X270N]  (hidden comment: C)
C406  DB_VALUE: 100uF  DB_TOLERANCE: 20%  DB_VOLTAGE: 6.3V  [SMD_1210_CAPC3225X270N]  (hidden comment: C)
C407  DB_VALUE: 100uF  DB_TOLERANCE: 20%  DB_VOLTAGE: 6.3V  [SMD_1210_CAPC3225X270N]  (hidden comment: C)
C408  DB_VALUE: 220uF  DB_TOLERANCE: 20%  DB_VOLTAGE: 6.3V  [SMD_1210_CAPC3225X279N]  (hidden comment: C)
C409  DB_VALUE: 220uF  DB_TOLERANCE: 20%  DB_VOLTAGE: 6.3V  [SMD_1210_CAPC3225X279N]  (hidden comment: C)
C410  DB_VALUE: 220uF  DB_TOLERANCE: 20%  DB_VOLTAGE: 6.3V  [SMD_1210_CAPC3225X279N]  (hidden comment: C)
C411  DB_VALUE: 220uF  DB_TOLERANCE: 20%  DB_VOLTAGE: 6.3V  [SMD_1210_CAPC3225X279N]  (hidden comment: C)
C412  DB_VALUE: 220uF  DB_TOLERANCE: 20%  DB_VOLTAGE: 6.3V  [SMD_1210_CAPC3225X279N]  (hidden comment: C)
C413  DB_VALUE: 220uF  DB_TOLERANCE: 20%  DB_VOLTAGE: 6.3V  [SMD_1210_CAPC3225X279N]  (hidden comment: C)
C414  DB_VALUE: 220uF  DB_TOLERANCE: 20%  DB_VOLTAGE: 6.3V  [SMD_1210_CAPC3225X279N]  (hidden comment: C)
C415  DB_VALUE: 220uF  DB_TOLERANCE: 20%  DB_VOLTAGE: 6.3V  [SMD_1210_CAPC3225X279N]  (hidden comment: C)
C416  DB_VALUE: 220uF  DB_TOLERANCE: 20%  DB_VOLTAGE: 6.3V  [SMD_1210_CAPC3225X279N]  (hidden comment: C)
C417  DB_VALUE: 220uF  DB_TOLERANCE: 20%  DB_VOLTAGE: 6.3V  [SMD_1210_CAPC3225X279N]  (hidden comment: C)
C418  DB_VALUE: 220uF  DB_TOLERANCE: 20%  DB_VOLTAGE: 6.3V  [SMD_1210_CAPC3225X279N]  (hidden comment: C)
C419  DB_VALUE: 220uF  DB_TOLERANCE: 20%  DB_VOLTAGE: 6.3V  [SMD_1210_CAPC3225X279N]  (hidden comment: C)
C420  DB_VALUE: 100uF  DB_TOLERANCE: 20%  DB_VOLTAGE: 6.3V  [SMD_1210_CAPC3225X270N]  (hidden comment: C)
C421  DB_VALUE: 100uF  DB_TOLERANCE: 20%  DB_VOLTAGE: 6.3V  [SMD_1210_CAPC3225X270N]  (hidden comment: C)
C422  DB_VALUE: 100uF  DB_TOLERANCE: 20%  DB_VOLTAGE: 6.3V  [SMD_1210_CAPC3225X270N]  (hidden comment: C)
C423  DB_VALUE: 100uF  DB_TOLERANCE: 20%  DB_VOLTAGE: 6.3V  [SMD_1210_CAPC3225X270N]  (hidden comment: C)
C424  DB_VALUE: 100uF  DB_TOLERANCE: 20%  DB_VOLTAGE: 6.3V  [SMD_1210_CAPC3225X270N]  (hidden comment: C)
C425  DB_VALUE: 100uF  DB_TOLERANCE: 20%  DB_VOLTAGE: 6.3V  [SMD_1210_CAPC3225X270N]  (hidden comment: C)
C426  DB_VALUE: 100uF  DB_TOLERANCE: 20%  DB_VOLTAGE: 6.3V  [SMD_1210_CAPC3225X270N]  (hidden comment: C)
C427  DB_VALUE: 100uF  DB_TOLERANCE: 20%  DB_VOLTAGE: 6.3V  [SMD_1210_CAPC3225X270N]  (hidden comment: C)
D10  D  DB_VALUE: 1N4448HWT  [SMD_SOD523_SOD1608X65N]
D11  D  DB_VALUE: 1N4448HWT  [SMD_SOD523_SOD1608X65N]
D12  D  DB_VALUE: 1N4448HWT  [SMD_SOD523_SOD1608X65N]
D13  D  DB_VALUE: 1N4448HWT  [SMD_SOD523_SOD1608X65N]
D14  D  DB_VALUE: 1N4448HWT  [SMD_SOD523_SOD1608X65N]
D15  D  DB_VALUE: 1N4448HWT  [SMD_SOD523_SOD1608X65N]
D16  D  DB_VALUE: 1N4448HWT  [SMD_SOD523_SOD1608X65N]
D17  D  DB_VALUE: 1N4448HWT  [SMD_SOD523_SOD1608X65N]
D18  D  DB_VALUE: 1N4448HWT  [SMD_SOD523_SOD1608X65N]
D19  D  DB_VALUE: 1N4448HWT  [SMD_SOD523_SOD1608X65N]
D20  D  DB_VALUE: 1N4448HWT  [SMD_SOD523_SOD1608X65N]
D21  D  DB_VALUE: 1N4448HWT  [SMD_SOD523_SOD1608X65N]
D22  D  DB_VALUE: 1N4448HWT  [SMD_SOD523_SOD1608X65N]
D23  D  DB_VALUE: 1N4448HWT  [SMD_SOD523_SOD1608X65N]
D24  D  DB_VALUE: 1N4448HWT  [SMD_SOD523_SOD1608X65N]
D25  D  DB_VALUE: 1N4448HWT  [SMD_SOD523_SOD1608X65N]
L1  L  [SMT_INDM135130X800N]
L2  L  [SMT_INDM135130X800N]
L3  L  [SMT_INDM135130X800N]
L4  L  [SMT_INDM135130X800N]
L5  L  [SMT_INDM135130X800N]
L6  L  [SMT_INDM135130X800N]
L7  L  [SMT_INDM135130X800N]
L8  L  [SMT_INDM135130X800N]
L9  L  [SMT_INDM135130X800N]
L10  L  [SMT_INDM135130X800N]
L11  L  [SMT_INDM135130X800N]
L12  L  [SMT_INDM135130X800N]
L13  L  [SMT_INDM135130X800N]
L14  L  [SMT_INDM135130X800N]
L15  L  [SMT_INDM135130X800N]
L16  L  [SMT_INDM135130X800N]
Q1  DB_VALUE: AP1RA03GMT-HF-3  [SMD_SOIC127P600X110-9AN]  (hidden comment: MOS_N_D1_S1S2S3G4D5D6D7D8)
Q2  DB_VALUE: AP1RA03GMT-HF-3  [SMD_SOIC127P600X110-9AN]  (hidden comment: MOS_N_D1_S1S2S3G4D5D6D7D8)
Q3  DB_VALUE: AP1RA03GMT-HF-3  [SMD_SOIC127P600X110-9AN]  (hidden comment: MOS_N_D1_S1S2S3G4D5D6D7D8)
Q4  DB_VALUE: AP1RA03GMT-HF-3  [SMD_SOIC127P600X110-9AN]  (hidden comment: MOS_N_D1_S1S2S3G4D5D6D7D8)
Q5  DB_VALUE: AP1RA03GMT-HF-3  [SMD_SOIC127P600X110-9AN]  (hidden comment: MOS_N_D1_S1S2S3G4D5D6D7D8)
Q6  DB_VALUE: AP1RA03GMT-HF-3  [SMD_SOIC127P600X110-9AN]  (hidden comment: MOS_N_D1_S1S2S3G4D5D6D7D8)
Q7  DB_VALUE: AP1RA03GMT-HF-3  [SMD_SOIC127P600X110-9AN]  (hidden comment: MOS_N_D1_S1S2S3G4D5D6D7D8)
Q8  DB_VALUE: AP1RA03GMT-HF-3  [SMD_SOIC127P600X110-9AN]  (hidden comment: MOS_N_D1_S1S2S3G4D5D6D7D8)
Q9  DB_VALUE: AP1RA03GMT-HF-3  [SMD_SOIC127P600X110-9AN]  (hidden comment: MOS_N_D1_S1S2S3G4D5D6D7D8)
Q10  DB_VALUE: AP1RA03GMT-HF-3  [SMD_SOIC127P600X110-9AN]  (hidden comment: MOS_N_D1_S1S2S3G4D5D6D7D8)
Q11  DB_VALUE: AP1RA03GMT-HF-3  [SMD_SOIC127P600X110-9AN]  (hidden comment: MOS_N_D1_S1S2S3G4D5D6D7D8)
Q12  DB_VALUE: AP1RA03GMT-HF-3  [SMD_SOIC127P600X110-9AN]  (hidden comment: MOS_N_D1_S1S2S3G4D5D6D7D8)
Q13  DB_VALUE: AP1RA03GMT-HF-3  [SMD_SOIC127P600X110-9AN]  (hidden comment: MOS_N_D1_S1S2S3G4D5D6D7D8)
Q14  DB_VALUE: AP1RA03GMT-HF-3  [SMD_SOIC127P600X110-9AN]  (hidden comment: MOS_N_D1_S1S2S3G4D5D6D7D8)
Q15  DB_VALUE: AP1RA03GMT-HF-3  [SMD_SOIC127P600X110-9AN]  (hidden comment: MOS_N_D1_S1S2S3G4D5D6D7D8)
Q16  DB_VALUE: AP1RA03GMT-HF-3  [SMD_SOIC127P600X110-9AN]  (hidden comment: MOS_N_D1_S1S2S3G4D5D6D7D8)
Q17  DB_VALUE: AP1RA03GMT-HF-3  [SMD_SOIC127P600X110-9AN]  (hidden comment: MOS_N_D1_S1S2S3G4D5D6D7D8)
Q18  DB_VALUE: AP1RA03GMT-HF-3  [SMD_SOIC127P600X110-9AN]  (hidden comment: MOS_N_D1_S1S2S3G4D5D6D7D8)
Q19  DB_VALUE: AP1RA03GMT-HF-3  [SMD_SOIC127P600X110-9AN]  (hidden comment: MOS_N_D1_S1S2S3G4D5D6D7D8)
Q20  DB_VALUE: AP1RA03GMT-HF-3  [SMD_SOIC127P600X110-9AN]  (hidden comment: MOS_N_D1_S1S2S3G4D5D6D7D8)
Q21  DB_VALUE: AP1RA03GMT-HF-3  [SMD_SOIC127P600X110-9AN]  (hidden comment: MOS_N_D1_S1S2S3G4D5D6D7D8)
Q22  DB_VALUE: AP1RA03GMT-HF-3  [SMD_SOIC127P600X110-9AN]  (hidden comment: MOS_N_D1_S1S2S3G4D5D6D7D8)
Q23  DB_VALUE: AP1RA03GMT-HF-3  [SMD_SOIC127P600X110-9AN]  (hidden comment: MOS_N_D1_S1S2S3G4D5D6D7D8)
Q24  DB_VALUE: AP1RA03GMT-HF-3  [SMD_SOIC127P600X110-9AN]  (hidden comment: MOS_N_D1_S1S2S3G4D5D6D7D8)
Q25  DB_VALUE: AP1RA03GMT-HF-3  [SMD_SOIC127P600X110-9AN]  (hidden comment: MOS_N_D1_S1S2S3G4D5D6D7D8)
Q26  DB_VALUE: AP1RA03GMT-HF-3  [SMD_SOIC127P600X110-9AN]  (hidden comment: MOS_N_D1_S1S2S3G4D5D6D7D8)
Q27  DB_VALUE: AP1RA03GMT-HF-3  [SMD_SOIC127P600X110-9AN]  (hidden comment: MOS_N_D1_S1S2S3G4D5D6D7D8)
Q28  DB_VALUE: AP1RA03GMT-HF-3  [SMD_SOIC127P600X110-9AN]  (hidden comment: MOS_N_D1_S1S2S3G4D5D6D7D8)
Q29  DB_VALUE: AP1RA03GMT-HF-3  [SMD_SOIC127P600X110-9AN]  (hidden comment: MOS_N_D1_S1S2S3G4D5D6D7D8)
Q30  DB_VALUE: AP1RA03GMT-HF-3  [SMD_SOIC127P600X110-9AN]  (hidden comment: MOS_N_D1_S1S2S3G4D5D6D7D8)
Q31  DB_VALUE: AP1RA03GMT-HF-3  [SMD_SOIC127P600X110-9AN]  (hidden comment: MOS_N_D1_S1S2S3G4D5D6D7D8)
Q32  DB_VALUE: AP1RA03GMT-HF-3  [SMD_SOIC127P600X110-9AN]  (hidden comment: MOS_N_D1_S1S2S3G4D5D6D7D8)
Q33  DB_VALUE: AP1RA03GMT-HF-3  [SMD_SOIC127P600X110-9AN]  (hidden comment: MOS_N_D1_S1S2S3G4D5D6D7D8)
Q34  DB_VALUE: AP1RA03GMT-HF-3  [SMD_SOIC127P600X110-9AN]  (hidden comment: MOS_N_D1_S1S2S3G4D5D6D7D8)
Q35  DB_VALUE: AP1RA03GMT-HF-3  [SMD_SOIC127P600X110-9AN]  (hidden comment: MOS_N_D1_S1S2S3G4D5D6D7D8)
Q36  DB_VALUE: AP1RA03GMT-HF-3  [SMD_SOIC127P600X110-9AN]  (hidden comment: MOS_N_D1_S1S2S3G4D5D6D7D8)
Q37  DB_VALUE: AP1RA03GMT-HF-3  [SMD_SOIC127P600X110-9AN]  (hidden comment: MOS_N_D1_S1S2S3G4D5D6D7D8)
Q38  DB_VALUE: AP1RA03GMT-HF-3  [SMD_SOIC127P600X110-9AN]  (hidden comment: MOS_N_D1_S1S2S3G4D5D6D7D8)
Q39  DB_VALUE: AP1RA03GMT-HF-3  [SMD_SOIC127P600X110-9AN]  (hidden comment: MOS_N_D1_S1S2S3G4D5D6D7D8)
Q40  DB_VALUE: AP1RA03GMT-HF-3  [SMD_SOIC127P600X110-9AN]  (hidden comment: MOS_N_D1_S1S2S3G4D5D6D7D8)
Q41  DB_VALUE: AP1RA03GMT-HF-3  [SMD_SOIC127P600X110-9AN]  (hidden comment: MOS_N_D1_S1S2S3G4D5D6D7D8)
Q42  DB_VALUE: AP1RA03GMT-HF-3  [SMD_SOIC127P600X110-9AN]  (hidden comment: MOS_N_D1_S1S2S3G4D5D6D7D8)
Q43  DB_VALUE: AP1RA03GMT-HF-3  [SMD_SOIC127P600X110-9AN]  (hidden comment: MOS_N_D1_S1S2S3G4D5D6D7D8)
Q44  DB_VALUE: AP1RA03GMT-HF-3  [SMD_SOIC127P600X110-9AN]  (hidden comment: MOS_N_D1_S1S2S3G4D5D6D7D8)
Q45  DB_VALUE: AP1RA03GMT-HF-3  [SMD_SOIC127P600X110-9AN]  (hidden comment: MOS_N_D1_S1S2S3G4D5D6D7D8)
Q46  DB_VALUE: AP1RA03GMT-HF-3  [SMD_SOIC127P600X110-9AN]  (hidden comment: MOS_N_D1_S1S2S3G4D5D6D7D8)
Q47  DB_VALUE: AP1RA03GMT-HF-3  [SMD_SOIC127P600X110-9AN]  (hidden comment: MOS_N_D1_S1S2S3G4D5D6D7D8)
Q48  DB_VALUE: AP1RA03GMT-HF-3  [SMD_SOIC127P600X110-9AN]  (hidden comment: MOS_N_D1_S1S2S3G4D5D6D7D8)
U11  IC_LTC4449  DB_VALUE: LTC4449EDCB#TRPBF  [SMD_SON45P300X200X80-9N]
U12  IC_LTC4449  DB_VALUE: LTC4449EDCB#TRPBF  [SMD_SON45P300X200X80-9N]
U13  IC_LTC4449  DB_VALUE: LTC4449EDCB#TRPBF  [SMD_SON45P300X200X80-9N]
U14  IC_LTC4449  DB_VALUE: LTC4449EDCB#TRPBF  [SMD_SON45P300X200X80-9N]
U15  IC_LTC4449  DB_VALUE: LTC4449EDCB#TRPBF  [SMD_SON45P300X200X80-9N]
U16  IC_LTC4449  DB_VALUE: LTC4449EDCB#TRPBF  [SMD_SON45P300X200X80-9N]
U17  IC_LTC4449  DB_VALUE: LTC4449EDCB#TRPBF  [SMD_SON45P300X200X80-9N]
U18  IC_LTC4449  DB_VALUE: LTC4449EDCB#TRPBF  [SMD_SON45P300X200X80-9N]
U19  IC_LTC4449  DB_VALUE: LTC4449EDCB#TRPBF  [SMD_SON45P300X200X80-9N]
U20  IC_LTC4449  DB_VALUE: LTC4449EDCB#TRPBF  [SMD_SON45P300X200X80-9N]
U21  IC_LTC4449  DB_VALUE: LTC4449EDCB#TRPBF  [SMD_SON45P300X200X80-9N]
U22  IC_LTC4449  DB_VALUE: LTC4449EDCB#TRPBF  [SMD_SON45P300X200X80-9N]
U23  IC_LTC4449  DB_VALUE: LTC4449EDCB#TRPBF  [SMD_SON45P300X200X80-9N]
U24  IC_LTC4449  DB_VALUE: LTC4449EDCB#TRPBF  [SMD_SON45P300X200X80-9N]
U25  IC_LTC4449  DB_VALUE: LTC4449EDCB#TRPBF  [SMD_SON45P300X200X80-9N]
U26  IC_LTC4449  DB_VALUE: LTC4449EDCB#TRPBF  [SMD_SON45P300X200X80-9N]

### Ports
1V, 3.3V, 5.0V, 12V, PWM1H, PWM1L, PWM2H, PWM2L, PWM3H, PWM3L, PWM4H, PWM4L

### Nets
GND: C20.1 C21.1 C22.1 C23.1 C24.2 C25.2 C26.2 C27.2 C32.1 C33.1 C34.1 C35.1 C37.1 C38.1 C39.1 C40.1 C41.1 C42.1 C43.1 C44.1 C45.1 C46.1 C47.1 C48.1 C49.1 C50.1 C51.1 C52.1 C53.1 C54.1 C55.1 C56.2 C57.2 C58.2 C59.2 C64.1 C65.1 C66.1 C67.1 C68.1 C69.1 C70.1 C71.1 C72.1 C73.1 C74.1 C75.1 C76.1 C77.1 C78.1 C79.1 C80.1 C81.1 C82.1 C83.1 C84.1 C85.1 C86.1 C87.1 C88.2 C89.2 C90.2 C91.2 C96.1 C97.1 C98.1 C99.1 C100.1 C101.1 C102.1 C103.1 C104.1 C105.1 C106.1 C107.1 C108.1 C109.1 C110.1 C111.1 C112.1 C113.1 C114.1 C115.1 C116.1 C117.1 C118.1 C119.1 C120.2 C121.2 C122.2 C123.2 C128.1 C129.1 C130.1 C131.1 C132.1 C133.1 C134.1 C135.1 C136.1 C137.1 C138.1 C139.1 C140.1 C141.1 C142.1 C143.1 C144.1 C145.1 C146.1 C147.1 C236.1 C348.1 C349.1 C350.1 C351.1 C352.1 C353.1 C354.1 C355.1 C356.1 C357.1 C358.1 C359.1 C360.1 C361.1 C362.1 C363.1 C364.1 C365.1 C366.1 C367.1 C368.1 C369.1 C370.1 C371.1 C372.1 C373.1 C374.1 C375.1 C376.1 C377.1 C378.1 C379.1 C380.1 C381.1 C382.1 C383.1 C384.1 C385.1 C386.1 C387.1 C388.1 C389.1 C390.1 C391.1 C392.1 C393.1 C394.1 C395.1 C396.1 C397.1 C398.1 C399.1 C400.1 C401.1 C402.1 C403.1 C404.1 C405.1 C406.1 C407.1 C408.1 C409.1 C410.1 C411.1 C412.1 C413.1 C414.1 C415.1 C416.1 C417.1 C418.1 C419.1 C420.1 C421.1 C422.1 C423.1 C424.1 C425.1 C426.1 C427.1 Q5.1(S) Q5.2(S) Q5.3(S) Q6.1(S) Q6.2(S) Q6.3(S) Q7.1(S) Q7.2(S) Q7.3(S) Q8.1(S) Q8.2(S) Q8.3(S) Q9.1(S) Q9.2(S) Q9.3(S) Q10.1(S) Q10.2(S) Q10.3(S) Q11.1(S) Q11.2(S) Q11.3(S) Q12.1(S) Q12.2(S) Q12.3(S) Q17.1(S) Q17.2(S) Q17.3(S) Q18.1(S) Q18.2(S) Q18.3(S) Q19.1(S) Q19.2(S) Q19.3(S) Q20.1(S) Q20.2(S) Q20.3(S) Q21.1(S) Q21.2(S) Q21.3(S) Q22.1(S) Q22.2(S) Q22.3(S) Q23.1(S) Q23.2(S) Q23.3(S) Q24.1(S) Q24.2(S) Q24.3(S) Q29.1(S) Q29.2(S) Q29.3(S) Q30.1(S) Q30.2(S) Q30.3(S) Q31.1(S) Q31.2(S) Q31.3(S) Q32.1(S) Q32.2(S) Q32.3(S) Q33.1(S) Q33.2(S) Q33.3(S) Q34.1(S) Q34.2(S) Q34.3(S) Q35.1(S) Q35.2(S) Q35.3(S) Q36.1(S) Q36.2(S) Q36.3(S) Q41.1(S) Q41.2(S) Q41.3(S) Q42.1(S) Q42.2(S) Q42.3(S) Q43.1(S) Q43.2(S) Q43.3(S) Q44.1(S) Q44.2(S) Q44.3(S) Q45.1(S) Q45.2(S) Q45.3(S) Q46.1(S) Q46.2(S) Q46.3(S) Q47.1(S) Q47.2(S) Q47.3(S) Q48.1(S) Q48.2(S) Q48.3(S) U11.4(GND) U11.9(EP) U12.4(GND) U12.9(EP) U13.4(GND) U13.9(EP) U14.4(GND) U14.9(EP) U15.4(GND) U15.9(EP) U16.4(GND) U16.9(EP) U17.4(GND) U17.9(EP) U18.4(GND) U18.9(EP) U19.4(GND) U19.9(EP) U20.4(GND) U20.9(EP) U21.4(GND) U21.9(EP) U22.4(GND) U22.9(EP) U23.4(GND) U23.9(EP) U24.4(GND) U24.9(EP) U25.4(GND) U25.9(EP) U26.4(GND) U26.9(EP)
1V: C34.2 C35.2 C39.2 C40.2 C41.2 C44.2 C45.2 C46.2 C49.2 C50.2 C51.2 C66.2 C67.2 C68.2 C71.2 C72.2 C73.2 C76.2 C77.2 C78.2 C81.2 C82.2 C83.2 C98.2 C99.2 C100.2 C103.2 C104.2 C105.2 C108.2 C109.2 C110.2 C113.2 C114.2 C115.2 C130.2 C131.2 C132.2 C135.2 C136.2 C137.2 C140.2 C141.2 C142.2 C145.2 C146.2 C147.2 C236.2 C350.2 C351.2 C352.2 C355.2 C356.2 C357.2 C360.2 C361.2 C362.2 C365.2 C366.2 C367.2 C370.2 C371.2 C372.2 C375.2 C376.2 C377.2 C380.2 C381.2 C382.2 C385.2 C386.2 C387.2 C388.2 C389.2 C390.2 C393.2 C394.2 C395.2 C396.2 C397.2 C398.2 C399.2 C400.2 C401.2 C408.2 C409.2 C410.2 C411.2 C412.2 C413.2 C414.2 C415.2 C416.2 C417.2 C418.2 C419.2 L1.2 L2.2 L3.2 L4.2 L5.2 L6.2 L7.2 L8.2 L9.2 L10.2 L11.2 L12.2 L13.2 L14.2 L15.2 L16.2 ; port 1V
3.3V: C24.1 C25.1 C26.1 C27.1 C56.1 C57.1 C58.1 C59.1 C88.1 C89.1 C90.1 C91.1 C120.1 C121.1 C122.1 C123.1 U11.6(VLOGIC) U12.6(VLOGIC) U13.6(VLOGIC) U14.6(VLOGIC) U15.6(VLOGIC) U16.6(VLOGIC) U17.6(VLOGIC) U18.6(VLOGIC) U19.6(VLOGIC) U20.6(VLOGIC) U21.6(VLOGIC) U22.6(VLOGIC) U23.6(VLOGIC) U24.6(VLOGIC) U25.6(VLOGIC) U26.6(VLOGIC) ; port 3.3V
5.0V: C20.2 C21.2 C22.2 C23.2 C52.2 C53.2 C54.2 C55.2 C84.2 C85.2 C86.2 C87.2 C116.2 C117.2 C118.2 C119.2 D10.2(A) D11.2(A) D12.2(A) D13.2(A) D14.2(A) D15.2(A) D16.2(A) D17.2(A) D18.2(A) D19.2(A) D20.2(A) D21.2(A) D22.2(A) D23.2(A) D24.2(A) D25.2(A) U11.7(VCC) U12.7(VCC) U13.7(VCC) U14.7(VCC) U15.7(VCC) U16.7(VCC) U17.7(VCC) U18.7(VCC) U19.7(VCC) U20.7(VCC) U21.7(VCC) U22.7(VCC) U23.7(VCC) U24.7(VCC) U25.7(VCC) U26.7(VCC) ; port 5.0V
12V: C32.2 C33.2 C37.2 C38.2 C42.2 C43.2 C47.2 C48.2 C64.2 C65.2 C69.2 C70.2 C74.2 C75.2 C79.2 C80.2 C96.2 C97.2 C101.2 C102.2 C106.2 C107.2 C111.2 C112.2 C128.2 C129.2 C133.2 C134.2 C138.2 C139.2 C143.2 C144.2 C348.2 C349.2 C353.2 C354.2 C358.2 C359.2 C363.2 C364.2 C368.2 C369.2 C373.2 C374.2 C378.2 C379.2 C383.2 C384.2 C391.2 C392.2 C402.2 C403.2 C404.2 C405.2 C406.2 C407.2 C420.2 C421.2 C422.2 C423.2 C424.2 C425.2 C426.2 C427.2 Q1.5(D) Q1.6(D) Q1.7(D) Q1.8(D) Q2.5(D) Q2.6(D) Q2.7(D) Q2.8(D) Q3.5(D) Q3.6(D) Q3.7(D) Q3.8(D) Q4.5(D) Q4.6(D) Q4.7(D) Q4.8(D) Q13.5(D) Q13.6(D) Q13.7(D) Q13.8(D) Q14.5(D) Q14.6(D) Q14.7(D) Q14.8(D) Q15.5(D) Q15.6(D) Q15.7(D) Q15.8(D) Q16.5(D) Q16.6(D) Q16.7(D) Q16.8(D) Q25.5(D) Q25.6(D) Q25.7(D) Q25.8(D) Q26.5(D) Q26.6(D) Q26.7(D) Q26.8(D) Q27.5(D) Q27.6(D) Q27.7(D) Q27.8(D) Q28.5(D) Q28.6(D) Q28.7(D) Q28.8(D) Q37.5(D) Q37.6(D) Q37.7(D) Q37.8(D) Q38.5(D) Q38.6(D) Q38.7(D) Q38.8(D) Q39.5(D) Q39.6(D) Q39.7(D) Q39.8(D) Q40.5(D) Q40.6(D) Q40.7(D) Q40.8(D) ; port 12V
BOOT1: C28.1 D10.1(C) U11.8(BOOST)
BOOT2: C60.1 D14.1(C) U15.8(BOOST)
BOOT3: C92.1 D18.1(C) U19.8(BOOST)
BOOT4: C124.1 D22.1(C) U23.8(BOOST)
BOOT5: C29.1 D11.1(C) U12.8(BOOST)
BOOT6: C61.1 D15.1(C) U16.8(BOOST)
BOOT7: C93.1 D19.1(C) U20.8(BOOST)
BOOT8: C125.1 D23.1(C) U24.8(BOOST)
BOOT9: C30.1 D12.1(C) U13.8(BOOST)
BOOT10: C62.1 D16.1(C) U17.8(BOOST)
BOOT11: C94.1 D20.1(C) U21.8(BOOST)
BOOT12: C126.1 D24.1(C) U25.8(BOOST)
BOOT13: C31.1 D13.1(C) U14.8(BOOST)
BOOT14: C63.1 D17.1(C) U18.8(BOOST)
BOOT15: C95.1 D21.1(C) U22.8(BOOST)
BOOT16: C127.1 D25.1(C) U26.8(BOOST)
HO1: Q1.4(G) U11.1(TG)
HO2: Q13.4(G) U15.1(TG)
HO3: Q25.4(G) U19.1(TG)
HO4: Q37.4(G) U23.1(TG)
HO5: Q2.4(G) U12.1(TG)
HO6: Q14.4(G) U16.1(TG)
HO7: Q26.4(G) U20.1(TG)
HO8: Q38.4(G) U24.1(TG)
HO9: Q3.4(G) U13.1(TG)
HO10: Q15.4(G) U17.1(TG)
HO11: Q27.4(G) U21.1(TG)
HO12: Q39.4(G) U25.1(TG)
HO13: Q4.4(G) U14.1(TG)
HO14: Q16.4(G) U18.1(TG)
HO15: Q28.4(G) U22.1(TG)
HO16: Q40.4(G) U26.1(TG)
LO1: Q5.4(G) Q6.4(G) U11.3(BG)
LO2: Q17.4(G) Q18.4(G) U15.3(BG)
LO3: Q29.4(G) Q30.4(G) U19.3(BG)
LO4: Q41.4(G) Q42.4(G) U23.3(BG)
LO5: Q7.4(G) Q8.4(G) U12.3(BG)
LO6: Q19.4(G) Q20.4(G) U16.3(BG)
LO7: Q31.4(G) Q32.4(G) U20.3(BG)
LO8: Q43.4(G) Q44.4(G) U24.3(BG)
LO9: Q9.4(G) Q10.4(G) U13.3(BG)
LO10: Q21.4(G) Q22.4(G) U17.3(BG)
LO11: Q33.4(G) Q34.4(G) U21.3(BG)
LO12: Q45.4(G) Q46.4(G) U25.3(BG)
LO13: Q11.4(G) Q12.4(G) U14.3(BG)
LO14: Q23.4(G) Q24.4(G) U18.3(BG)
LO15: Q35.4(G) Q36.4(G) U22.3(BG)
LO16: Q47.4(G) Q48.4(G) U26.3(BG)
PWM1H: U12.5(IN) U14.5(IN) ; port PWM1H
PWM1L: U11.5(IN) U13.5(IN) ; port PWM1L
PWM2H: U16.5(IN) U18.5(IN) ; port PWM2H
PWM2L: U15.5(IN) U17.5(IN) ; port PWM2L
PWM3H: U20.5(IN) U22.5(IN) ; port PWM3H
PWM3L: U19.5(IN) U21.5(IN) ; port PWM3L
PWM4H: U24.5(IN) U26.5(IN) ; port PWM4H
PWM4L: U23.5(IN) U25.5(IN) ; port PWM4L
SWN1: C28.2 L1.1 Q1.1(S) Q1.2(S) Q1.3(S) Q5.5(D) Q5.6(D) Q5.7(D) Q5.8(D) Q6.5(D) Q6.6(D) Q6.7(D) Q6.8(D) U11.2(TS)
SWN2: C60.2 L5.1 Q13.1(S) Q13.2(S) Q13.3(S) Q17.5(D) Q17.6(D) Q17.7(D) Q17.8(D) Q18.5(D) Q18.6(D) Q18.7(D) Q18.8(D) U15.2(TS)
SWN3: C92.2 L9.1 Q25.1(S) Q25.2(S) Q25.3(S) Q29.5(D) Q29.6(D) Q29.7(D) Q29.8(D) Q30.5(D) Q30.6(D) Q30.7(D) Q30.8(D) U19.2(TS)
SWN4: C124.2 L13.1 Q37.1(S) Q37.2(S) Q37.3(S) Q41.5(D) Q41.6(D) Q41.7(D) Q41.8(D) Q42.5(D) Q42.6(D) Q42.7(D) Q42.8(D) U23.2(TS)
SWN5: C29.2 L2.1 Q2.1(S) Q2.2(S) Q2.3(S) Q7.5(D) Q7.6(D) Q7.7(D) Q7.8(D) Q8.5(D) Q8.6(D) Q8.7(D) Q8.8(D) U12.2(TS)
SWN6: C61.2 L6.1 Q14.1(S) Q14.2(S) Q14.3(S) Q19.5(D) Q19.6(D) Q19.7(D) Q19.8(D) Q20.5(D) Q20.6(D) Q20.7(D) Q20.8(D) U16.2(TS)
SWN7: C93.2 L10.1 Q26.1(S) Q26.2(S) Q26.3(S) Q31.5(D) Q31.6(D) Q31.7(D) Q31.8(D) Q32.5(D) Q32.6(D) Q32.7(D) Q32.8(D) U20.2(TS)
SWN8: C125.2 L14.1 Q38.1(S) Q38.2(S) Q38.3(S) Q43.5(D) Q43.6(D) Q43.7(D) Q43.8(D) Q44.5(D) Q44.6(D) Q44.7(D) Q44.8(D) U24.2(TS)
SWN9: C30.2 L3.1 Q3.1(S) Q3.2(S) Q3.3(S) Q9.5(D) Q9.6(D) Q9.7(D) Q9.8(D) Q10.5(D) Q10.6(D) Q10.7(D) Q10.8(D) U13.2(TS)
SWN10: C62.2 L7.1 Q15.1(S) Q15.2(S) Q15.3(S) Q21.5(D) Q21.6(D) Q21.7(D) Q21.8(D) Q22.5(D) Q22.6(D) Q22.7(D) Q22.8(D) U17.2(TS)
SWN11: C94.2 L11.1 Q27.1(S) Q27.2(S) Q27.3(S) Q33.5(D) Q33.6(D) Q33.7(D) Q33.8(D) Q34.5(D) Q34.6(D) Q34.7(D) Q34.8(D) U21.2(TS)
SWN12: C126.2 L15.1 Q39.1(S) Q39.2(S) Q39.3(S) Q45.5(D) Q45.6(D) Q45.7(D) Q45.8(D) Q46.5(D) Q46.6(D) Q46.7(D) Q46.8(D) U25.2(TS)
SWN13: C31.2 L4.1 Q4.1(S) Q4.2(S) Q4.3(S) Q11.5(D) Q11.6(D) Q11.7(D) Q11.8(D) Q12.5(D) Q12.6(D) Q12.7(D) Q12.8(D) U14.2(TS)
SWN14: C63.2 L8.1 Q16.1(S) Q16.2(S) Q16.3(S) Q23.5(D) Q23.6(D) Q23.7(D) Q23.8(D) Q24.5(D) Q24.6(D) Q24.7(D) Q24.8(D) U18.2(TS)
SWN15: C95.2 L12.1 Q28.1(S) Q28.2(S) Q28.3(S) Q35.5(D) Q35.6(D) Q35.7(D) Q35.8(D) Q36.5(D) Q36.6(D) Q36.7(D) Q36.8(D) U22.2(TS)
SWN16: C127.2 L16.1 Q40.1(S) Q40.2(S) Q40.3(S) Q47.5(D) Q47.6(D) Q47.7(D) Q47.8(D) Q48.5(D) Q48.6(D) Q48.7(D) Q48.8(D) U26.2(TS)

### Library data of the parts
C20-C23 C52-C55 C84-C87 C116-C119 = CAP000043646: DB_MANUFACTURER_PART: KEMET    C0603C106M9PAC; DB_PART_TYPE: Ceramic_SMD\Standard_X5R; NOTE: <NOTE>; DB_DESCRIPTION: C X5R 10uF 20% 6.3V 0603; DB_PACKAGE: 0603; DB_STATUS: NEW; DB_T_RANGE: -55 to 85; DB_PART_NUMBER: CAP000043646; DB_APPROVED_ON: 09.10.2010; DB_DATASHEET: http://john.epiqdesign.com/projects/CIS_Datasheets/F3102_CE_Kemet.pdf?rev=92&sc=0; DB_PCB_DEVICE: SMD_0603_CAPC1608X95N
C24-C27 C56-C59 C88-C91 C120-C123 = CAP000022751: DB_PART_TYPE: Ceramic_SMD\Open_Mode_X7R; DB_MANUFACTURER_PART: KEMET    C0402F104M4RAC; NOTE: <NOTE>; DB_T_RANGE: -55 to 125; DB_PACKAGE: 0402; DB_DESCRIPTION: C X7R 100nF 20% 16V 0402; DB_STATUS: NEW; DB_PART_NUMBER: CAP000022751; DB_PCB_DEVICE: SMD_0402_CAPC1005X55N; DB_APPROVED_ON: 09.10.2010; DB_DATASHEET: http://john.epiqdesign.com/projects/CIS_Datasheets/F3102_CE_Kemet.pdf?rev=92&sc=0
C28-C31 C60-C63 C92-C95 C124-C127 = CAP000022968: DB_PART_TYPE: Ceramic_SMD\Open_Mode_X7R; DB_MANUFACTURER_PART: KEMET    C0603F224K3RAC; NOTE: <NOTE>; DB_T_RANGE: -55 to 125; DB_PACKAGE: 0603; DB_DESCRIPTION: C X7R 220nF 10% 25V 0603; DB_STATUS: NEW; DB_PART_NUMBER: CAP000022968; DB_PCB_DEVICE: SMD_0603_CAPC1608X95N; DB_APPROVED_ON: 09.10.2010; DB_DATASHEET: http://john.epiqdesign.com/projects/CIS_Datasheets/F3102_CE_Kemet.pdf?rev=92&sc=0
C32 C33 C37 C38 C42 C43 C47 C48 C64 C65 C69 C70 C74 C75 C79 C80 C96 C97 C101 C102 C106 C107 C111 C112 C128 C129 C133 C134 C138 C139 C143 C144 C348 C349 C353 C354 C358 C359 C363 C364 C368 C369 C373 C374 C378 C379 C383 C384 C391 C392 C402-C407 C420-C427 = CAP000043701: DB_PART_TYPE: Ceramic_SMD\Standard_X5R; DB_MANUFACTURER_PART: KEMET    C1210C107M9PAC; NOTE: <NOTE>; DB_T_RANGE: -55 to 85; DB_PACKAGE: 1210; DB_DESCRIPTION: C X5R 100uF 20% 6.3V 1210; DB_STATUS: NEW; DB_PART_NUMBER: CAP000043701; DB_PCB_DEVICE: SMD_1210_CAPC3225X270N; DB_APPROVED_ON: 09.10.2010; DB_DATASHEET: http://john.epiqdesign.com/projects/CIS_Datasheets/F3102_CE_Kemet.pdf?rev=92&sc=0
C34 C35 C39-C41 C44-C46 C49-C51 C66-C68 C71-C73 C76-C78 C81-C83 C98-C100 C103-C105 C108-C110 C113-C115 C130-C132 C135-C137 C140-C142 C145-C147 C236 C350-C352 C355-C357 C360-C362 C365-C367 C370-C372 C375-C377 C380-C382 C385-C390 C393-C401 C408-C419 = CAP000047355: DB_PART_TYPE: Ceramic_SMD\Standard_X5R; DB_MANUFACTURER_PART: SAMSUNG    CL32A227MQVNNNE; NOTE: <NOTE>; DB_T_RANGE: -55 to 85; DB_PACKAGE: 1210; DB_DESCRIPTION: C X5R 220uF 20% 6.3V 1210; DB_APPROVED_BY: VSN; DB_STATUS: NEW; DB_PART_NUMBER: CAP000047355; DB_PCB_DEVICE: SMD_1210_CAPC3225X279N; DB_APPROVED_ON: 07.05.2014 11:28:08; DB_DATASHEET: http://john.epiqdesign.com/projects/CIS_Datasheets/CAP_CL32A227MQVNNNE.pdf?rev=1401&sc=0
D10-D25 = DDE000001203: DB_PART_TYPE: Fast; DB_MANUFACTURER_PART: Diodes        1N4448HWT; NOTE: <NOTE>; DB_T_RANGE: -65 to 150; DB_VOLTAGE: 80V; DB_CURRENT: 125mA; DB_PACKAGE: SOD523; DB_DESCRIPTION: D 1N4448HWT SOD523; DB_STATUS: NEW; DB_PART_NUMBER: DDE000001203; DB_PCB_DEVICE: SMD_SOD523_SOD1608X65N; DB_APPROVED_ON: 09.10.2010
Q1-Q48 = TRA000001604: DB_PART_TYPE: MOSFET\N_Channel; DB_MANUFACTURER_PART: ADVANCED POWER ELECTRONICS CORP      AP1RA03GMT-HF-3; NOTE: <NOTE>; DB_T_RANGE: -55 to 150; DB_VOLTAGE: 30V; DB_CURRENT: 185A; DB_PACKAGE: PQFN 5x6B; DB_DESCRIPTION: TRANS AP1RA03GMT-HF-3 PQFN 5x6B; DB_APPROVED_BY: VSN; DB_STATUS: NEW; DB_PART_NUMBER: TRA000001604; DB_PCB_DEVICE: SMD_SOIC127P600X110-9AN; DB_APPROVED_ON: 07.05.2014 12:55:44; DB_DATASHEET: http://john.epiqdesign.com/projects/CIS_Datasheets/MOS_AP1RA03GMT-3.pdf?rev=1404&sc=0
U11-U26 = DRV000000079: DB_PART_TYPE: Power Driver; DB_MANUFACTURER_PART: LINEAR       LTC4449EDCB#TRPBF; DB_T_RANGE: -40 to 125; DB_PACKAGE: DFN-8 (2mmX3mm); DB_DESCRIPTION: IC  LTC4449EDCB#TRPBF   DFN-8 (2mmX3mm); DB_APPROVED_BY: VSN; DB_STATUS: NEW; DB_PART_NUMBER: DRV000000079; DB_PCB_DEVICE: SMD_SON45P300X200X80-9N; DB_APPROVED_ON: 07.05.2014 13:09:30; DB_DATASHEET: http://john.epiqdesign.com/projects/CIS_Datasheets/IC_LTC4449.pdf?rev=1406&sc=0
L1-L16 = L: DB_PCB_DEVICE: SMT_INDM135130X800N

## Nets that join several sheets
GND: CPU_Power (1020 pins), CPU_Logic (44 pins), MCU (111 pins), SMPS (320 pins)

## Assembly variants
Production 220uF: not fitted C242 C243 C244 C245 C246 C247 C248 C249 D5 D7 Q49 Q50 Q52 Q53 R1 R2 R3 R15 R16 R17 R19 R23 R24 R37 R39 R41 R43 U5 U8 U27 U28 U30 U31 U32 U33 U34 Y2 Y3 Y4 Y5 YO1 YO2 YO3 YO4 YO9 YO10 YO11 YO12